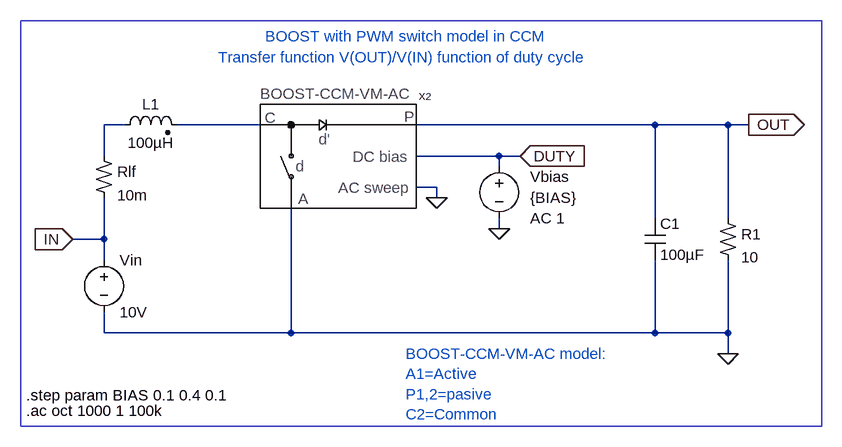
[diagram p0: schematic Switch-Mode Power Supplies - Basso- Figure 2-26.asc]
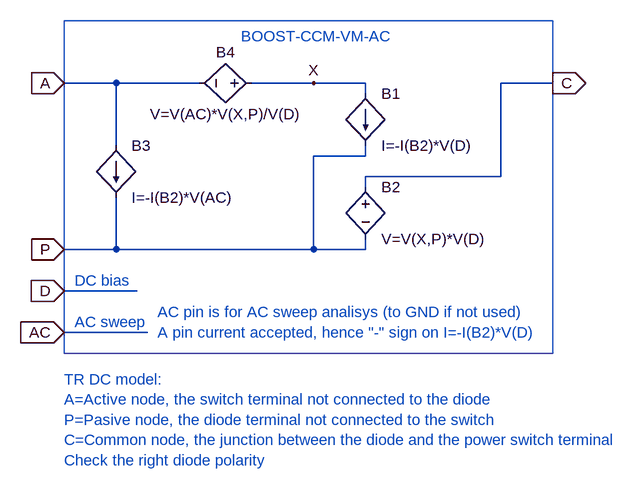
[diagram p1: sub-circuit boost-ccm-vm-ac.asc]
Switch-Mode Power Supplies - Basso- Figure 2-26.asc, the LTspice schematic file:
Version 4
SHEET 1 880 680
WIRE -976 -272 -1008 -272
WIRE -768 -272 -896 -272
WIRE -160 -272 -528 -272
WIRE -48 -272 -160 -272
WIRE -16 -272 -48 -272
WIRE -1008 -224 -1008 -272
WIRE -400 -224 -528 -224
WIRE -368 -224 -400 -224
WIRE -400 -208 -400 -224
WIRE -496 -176 -528 -176
WIRE -496 -160 -496 -176
WIRE -160 -128 -160 -272
WIRE -48 -128 -48 -272
WIRE -400 -112 -400 -128
WIRE -1008 -96 -1008 -160
WIRE -1008 -96 -1056 -96
WIRE -1008 -64 -1008 -96
WIRE -1008 48 -1008 16
WIRE -720 48 -720 -144
WIRE -720 48 -1008 48
WIRE -160 48 -160 -64
WIRE -160 48 -720 48
WIRE -48 48 -48 -64
WIRE -48 48 -160 48
WIRE -48 80 -48 48
FLAG -400 -112 0
FLAG -16 -272 OUT
IOPIN -16 -272 Out
FLAG -1056 -96 IN
IOPIN -1056 -96 In
FLAG -48 80 0
FLAG -368 -224 DUTY
IOPIN -368 -224 In
FLAG -496 -160 0
SYMBOL voltage -1008 -80 R0
WINDOW 123 0 0 Left 0
WINDOW 39 0 0 Left 0
SYMATTR InstName Vin
SYMATTR Value 10V
SYMBOL voltage -400 -224 R0
WINDOW 123 48 96 Left 0
WINDOW 39 0 0 Left 0
WINDOW 0 48 32 Left 0
WINDOW 3 48 64 Left 0
SYMATTR Value2 AC 1
SYMATTR InstName Vbias
SYMATTR Value {BIAS}
SYMBOL ind2 -992 -256 R270
WINDOW 0 32 56 VTop 0
WINDOW 3 4 56 VBottom 0
SYMATTR InstName L1
SYMATTR Value 100µH
SYMBOL cap -176 -128 R0
SYMATTR InstName C1
SYMATTR Value 100µF
SYMBOL res2 -64 -128 R0
SYMATTR InstName R1
SYMATTR Value 10
SYMBOL res2 -1024 -224 R0
SYMATTR InstName Rlf
SYMATTR Value 10m
SYMBOL BOOST-CCM-VM-AC -592 -240 R0
SYMATTR InstName X2
TEXT -1128 168 Left 0 !.ac oct 1000 1 100k
TEXT -544 80 Left 0 ;BOOST-CCM-VM-AC model:\nA1=Active\nP1,2=pasive\nC2=Common
TEXT -1128 144 Left 0 !.step param BIAS 0.1 0.4 0.1
TEXT -760 -408 Left 0 ;BOOST with PWM switch model in CCM
TEXT -832 -376 Left 0 ;Transfer function V(OUT)/V(IN) function of duty cycle
RECTANGLE Normal 96 192 -1136 -432

boost-ccm-vm-ac.asc, the sub-circuit schematic file:
Version 4
SHEET 1 944 680
WIRE 32 32 -48 32
WIRE 160 32 32 32
WIRE 336 32 240 32
WIRE 416 32 336 32
WIRE 704 32 624 32
WIRE 416 48 416 32
WIRE 32 128 32 32
WIRE 416 144 416 128
WIRE 416 144 336 144
WIRE 624 176 624 32
WIRE 624 176 416 176
WIRE 416 192 416 176
WIRE 32 288 32 208
WIRE 32 288 -48 288
WIRE 336 288 336 144
WIRE 336 288 32 288
WIRE 416 288 416 272
WIRE 416 288 336 288
WIRE 64 352 -48 352
WIRE 80 416 -48 416
FLAG -48 32 A
IOPIN -48 32 In
FLAG -48 288 P
IOPIN -48 288 In
FLAG 704 32 C
IOPIN 704 32 Out
FLAG -48 352 D
IOPIN -48 352 In
FLAG -48 416 AC
IOPIN -48 416 In
FLAG 336 32 X
SYMBOL bi 416 48 R0
SYMATTR InstName B1
SYMATTR Value I=-I(B2)*V(D)
SYMBOL bv 416 176 R0
SYMATTR InstName B2
SYMATTR Value V=V(X,P)*V(D)
SYMBOL bv 256 32 R90
WINDOW 0 -32 56 VBottom 0
WINDOW 3 32 56 VTop 0
SYMATTR InstName B4
SYMATTR Value V=V(AC)*V(X,P)/V(D)
SYMBOL bi 32 128 R0
SYMATTR InstName B3
SYMATTR Value I=-I(B2)*V(AC)
TEXT 224 -40 Left 0 ;BOOST-CCM-VM-AC
TEXT 96 416 Left 0 ;A pin current accepted, hence "-" sign on I=-I(B2)*V(D)
TEXT -48 488 Left 0 ;TR DC model:\nA=Active node, the switch terminal not connected to the diode\nP=Pasive node, the diode terminal not connected to the switch\nC=Common node, the junction between the diode and the power switch terminal\nCheck the right diode polarity
TEXT -32 400 Left 0 ;AC sweep
TEXT -32 336 Left 0 ;DC bias
TEXT 96 384 Left 0 ;AC pin is for AC sweep analisys (to GND if not used)
RECTANGLE Normal 704 448 -48 -64

The netlist it stands for:
* Switch-Mode Power Supplies - Basso- Figure 2-26.asc
Vin IN 0 10V
Vbias DUTY 0 {BIAS} AC 1
L1 N001 N002 100µH
C1 OUT 0 100µF
R1 OUT 0 10
Rlf N001 IN 10m
XX2 0 OUT DUTY N002 0 boost-ccm-vm-ac

* block symbol definitions
.subckt boost-ccm-vm-ac A P D C AC
B1 X P I=-I(B2)*V(D)
B2 C P V=V(X,P)*V(D)
B4 X A V=V(AC)*V(X,P)/V(D)
B3 A P I=-I(B2)*V(AC)
* BOOST-CCM-VM-AC
* A pin current accepted, hence "-" sign on I=-I(B2)*V(D)
* TR DC model:
* A=Active node, the switch terminal not connected to the diode
* P=Pasive node, the diode terminal not connected to the switch
* C=Common node, the junction between the diode and the power switch terminal
* Check the right diode polarity
* AC sweep
* DC bias
* AC pin is for AC sweep analisys (to GND if not used)
.ends boost-ccm-vm-ac

.ac oct 1000 1 100k
* BOOST-CCM-VM-AC model:
* A1=Active
* P1,2=pasive
* C2=Common
.step param BIAS 0.1 0.4 0.1
* BOOST with PWM switch model in CCM
* Transfer function V(OUT)/V(IN) function of duty cycle
.backanno
.end